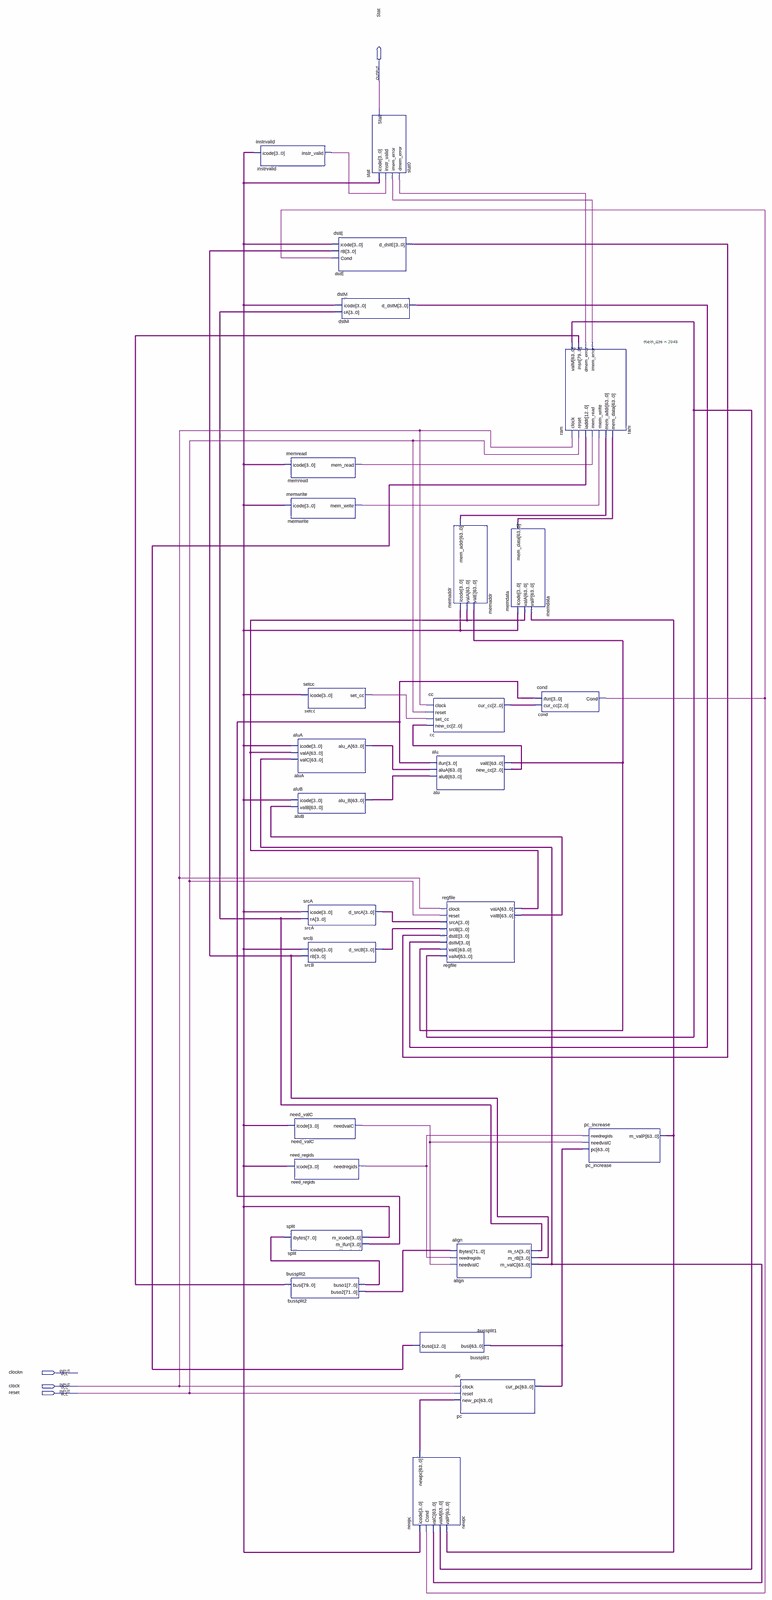
[diagram p0: schematic sheet, whole]
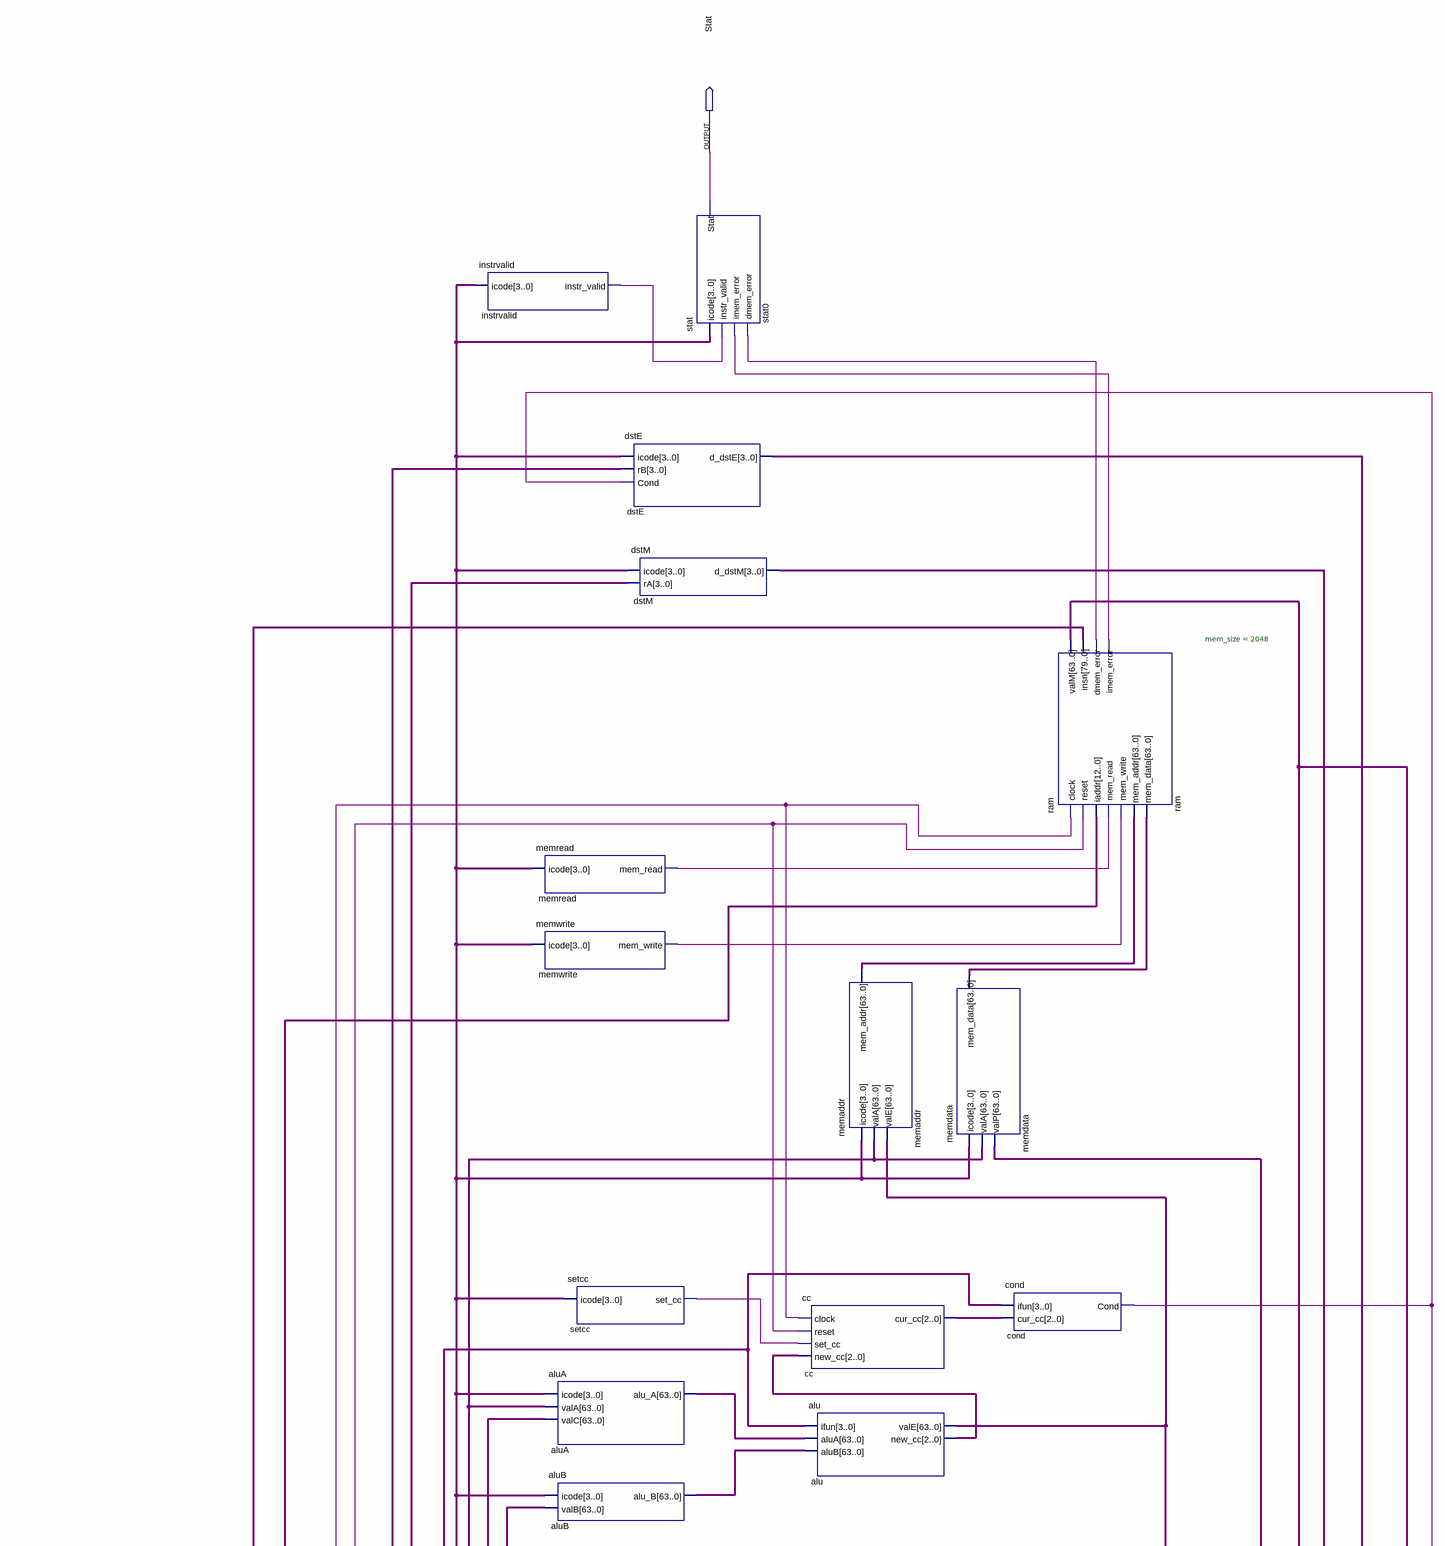
[diagram p1: schematic sheet, upper part]
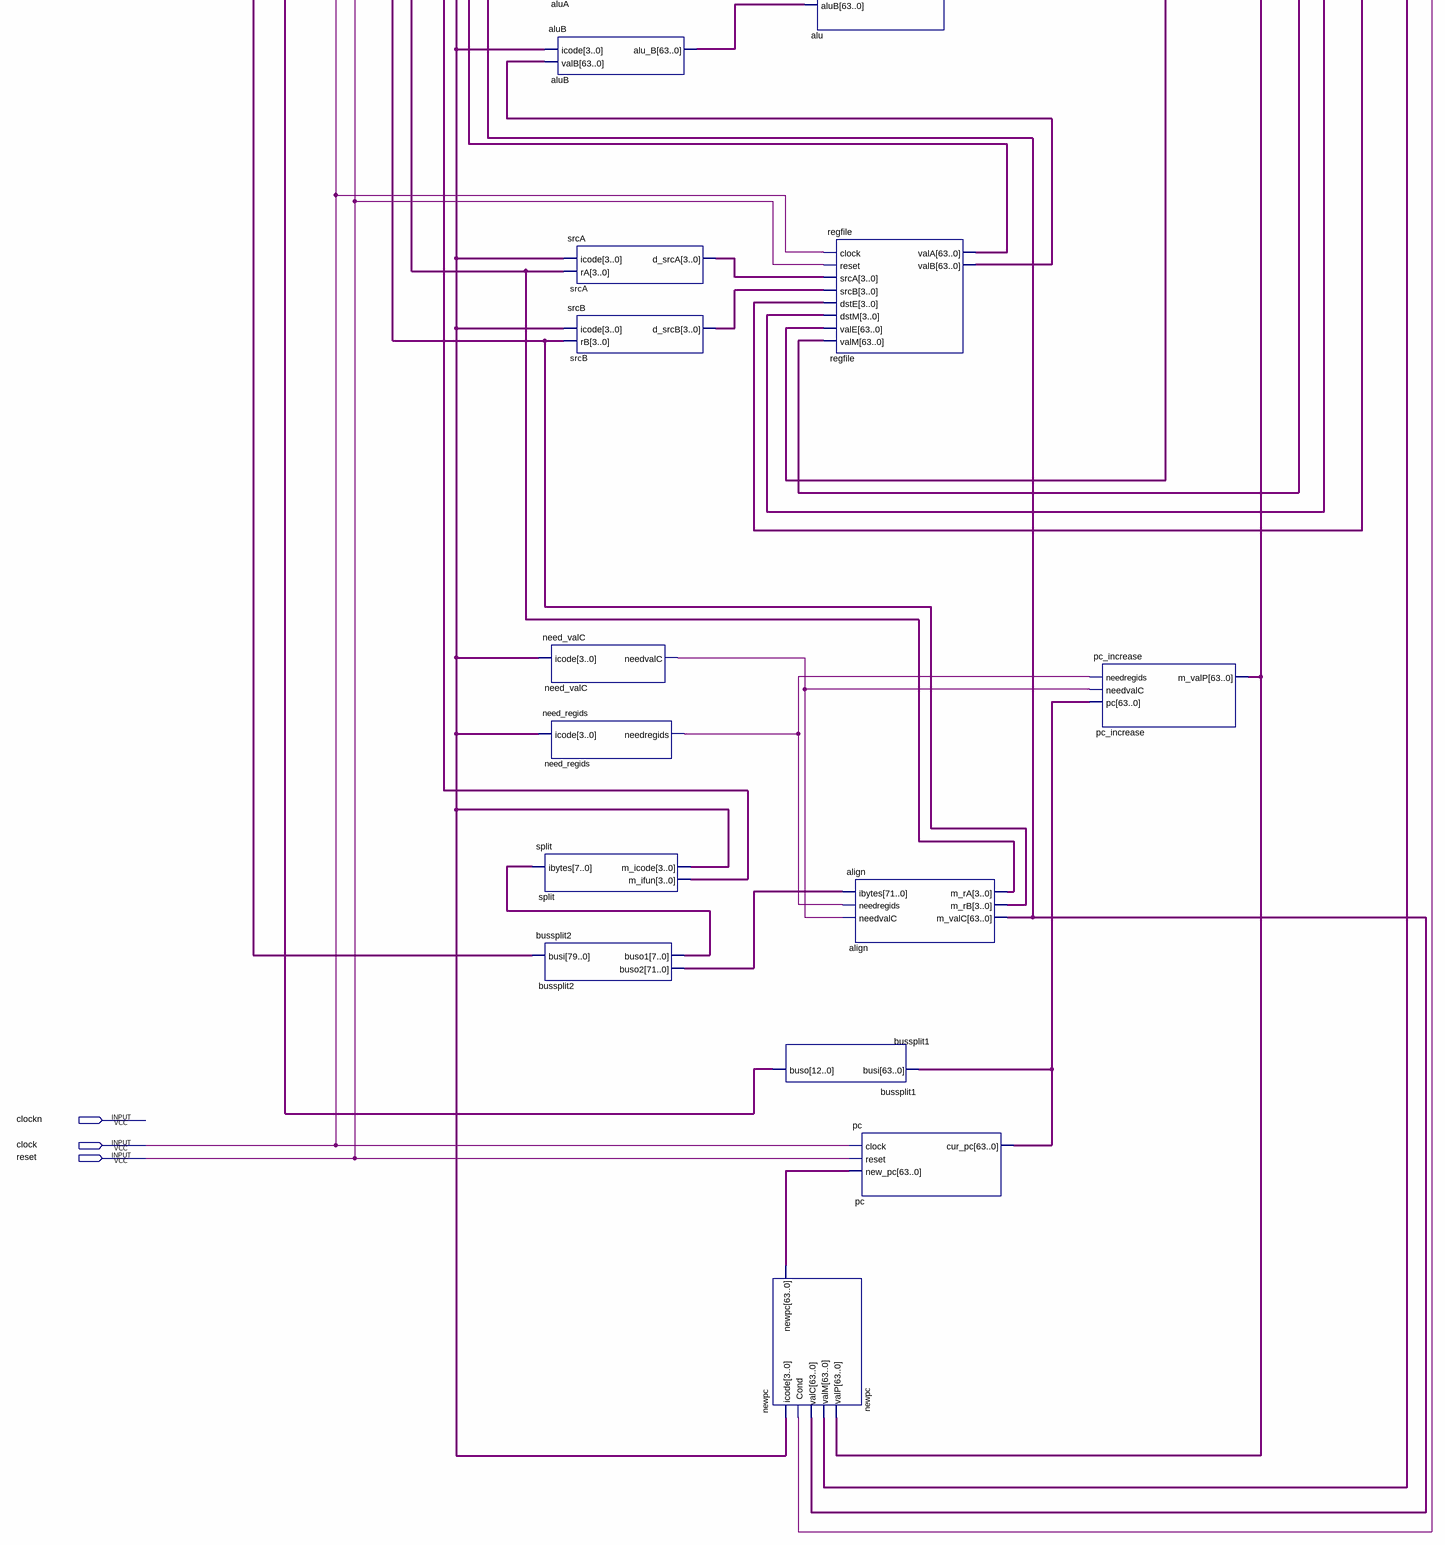
[diagram p2: schematic sheet, lower part]
// Quartus schematic y86seq.bdf as structural Verilog: 27 symbols, 4 pins
module y86seq (
  input  clockn,
  input  clock,
  input  reset,
  output Stat
);

  wire cond_cond, instrvalid_instr_valid, memread_mem_read, memwrite_mem_write, need_regids_needregids,
       need_valC_needvalc, ram_dmem_error, ram_imem_error, setcc_set_cc;
  wire [2:0] alu_new_cc, cc_cur_cc;
  wire [3:0] align_m_ra, align_m_rb, dstE_d_dste, dstM_d_dstm, split_m_icode, split_m_ifun, srcA_d_srca,
       srcB_d_srcb;
  wire [7:0] bussplit2_buso1;
  wire [12:0] bussplit1_buso;
  wire [63:0] align_m_valc, alu_vale, aluA_alu_a, aluB_alu_b, memaddr_mem_addr, memdata_mem_data,
       newpc_newpc, pc_cur_pc, pc_increase_m_valp, ram_valm, regfile_vala, regfile_valb;
  wire [71:0] bussplit2_buso2;
  wire [79:0] ram_insn;

  instrvalid instrvalid (.icode(split_m_icode), .instr_valid(instrvalid_instr_valid));
  memread memread (.icode(split_m_icode), .mem_read(memread_mem_read));
  memwrite memwrite (.icode(split_m_icode), .mem_write(memwrite_mem_write));
  aluA aluA (.icode(split_m_icode), .valA(regfile_vala), .valC(align_m_valc), .alu_A(aluA_alu_a));
  aluB aluB (.icode(split_m_icode), .valB(regfile_valb), .alu_B(aluB_alu_b));
  need_valC need_valC (.icode(split_m_icode), .needvalC(need_valC_needvalc));
  need_regids need_regids (.icode(split_m_icode), .needregids(need_regids_needregids));
  split split (.ibytes(bussplit2_buso1), .m_icode(split_m_icode), .m_ifun(split_m_ifun));
  bussplit2 bussplit2 (.busi(ram_insn), .buso1(bussplit2_buso1), .buso2(bussplit2_buso2));
  setcc setcc (.icode(split_m_icode), .set_cc(setcc_set_cc));
  srcA srcA (.icode(split_m_icode), .rA(align_m_ra), .d_srcA(srcA_d_srca));
  srcB srcB (.icode(split_m_icode), .rB(align_m_rb), .d_srcB(srcB_d_srcb));
  dstE dstE (.icode(split_m_icode), .rB(align_m_rb), .Cond(cond_cond), .d_dstE(dstE_d_dste));
  dstM dstM (.icode(split_m_icode), .rA(align_m_ra), .d_dstM(dstM_d_dstm));
  stat stat0 (
    .icode(split_m_icode), .instr_valid(instrvalid_instr_valid), .imem_error(ram_imem_error),
    .dmem_error(ram_dmem_error), .Stat(Stat));
  cc cc (.clock(clock), .reset(reset), .set_cc(setcc_set_cc), .new_cc(alu_new_cc), .cur_cc(cc_cur_cc));
  bussplit1 bussplit1 (.busi(pc_cur_pc), .buso(bussplit1_buso));
  newpc newpc (
    .icode(split_m_icode), .Cond(cond_cond), .valC(align_m_valc), .valM(ram_valm), .valP(pc_increase_m_valp),
    .newpc(newpc_newpc));
  memaddr memaddr (.icode(split_m_icode), .valA(regfile_vala), .valE(alu_vale), .mem_addr(memaddr_mem_addr));
  alu alu (.ifun(split_m_ifun), .aluA(aluA_alu_a), .aluB(aluB_alu_b), .valE(alu_vale), .new_cc(alu_new_cc));
  regfile regfile (
    .clock(clock), .reset(reset), .srcA(srcA_d_srca), .srcB(srcB_d_srcb), .dstE(dstE_d_dste),
    .dstM(dstM_d_dstm), .valE(alu_vale), .valM(ram_valm), .valA(regfile_vala), .valB(regfile_valb));
  align align (
    .ibytes(bussplit2_buso2), .needregids(need_regids_needregids), .needvalC(need_valC_needvalc),
    .m_rA(align_m_ra), .m_rB(align_m_rb), .m_valC(align_m_valc));
  pc pc (.clock(clock), .reset(reset), .new_pc(newpc_newpc), .cur_pc(pc_cur_pc));
  memdata memdata (.icode(split_m_icode), .valA(regfile_vala), .valP(pc_increase_m_valp), .mem_data(memdata_mem_data));
  cond cond (.ifun(split_m_ifun), .cur_cc(cc_cur_cc), .Cond(cond_cond));
  ram #(.mem_size(2048)) ram (
    .clock(clock), .reset(reset), .iaddr(bussplit1_buso), .mem_read(memread_mem_read),
    .mem_write(memwrite_mem_write), .mem_addr(memaddr_mem_addr), .mem_data(memdata_mem_data),
    .valM(ram_valm), .insn(ram_insn), .dmem_error(ram_dmem_error), .imem_error(ram_imem_error));
  pc_increase pc_increase (
    .needregids(need_regids_needregids), .needvalC(need_valC_needvalc), .pc(pc_cur_pc),
    .m_valP(pc_increase_m_valp));
endmodule
